# EAGLE design lamp (EAGLE 6.2)
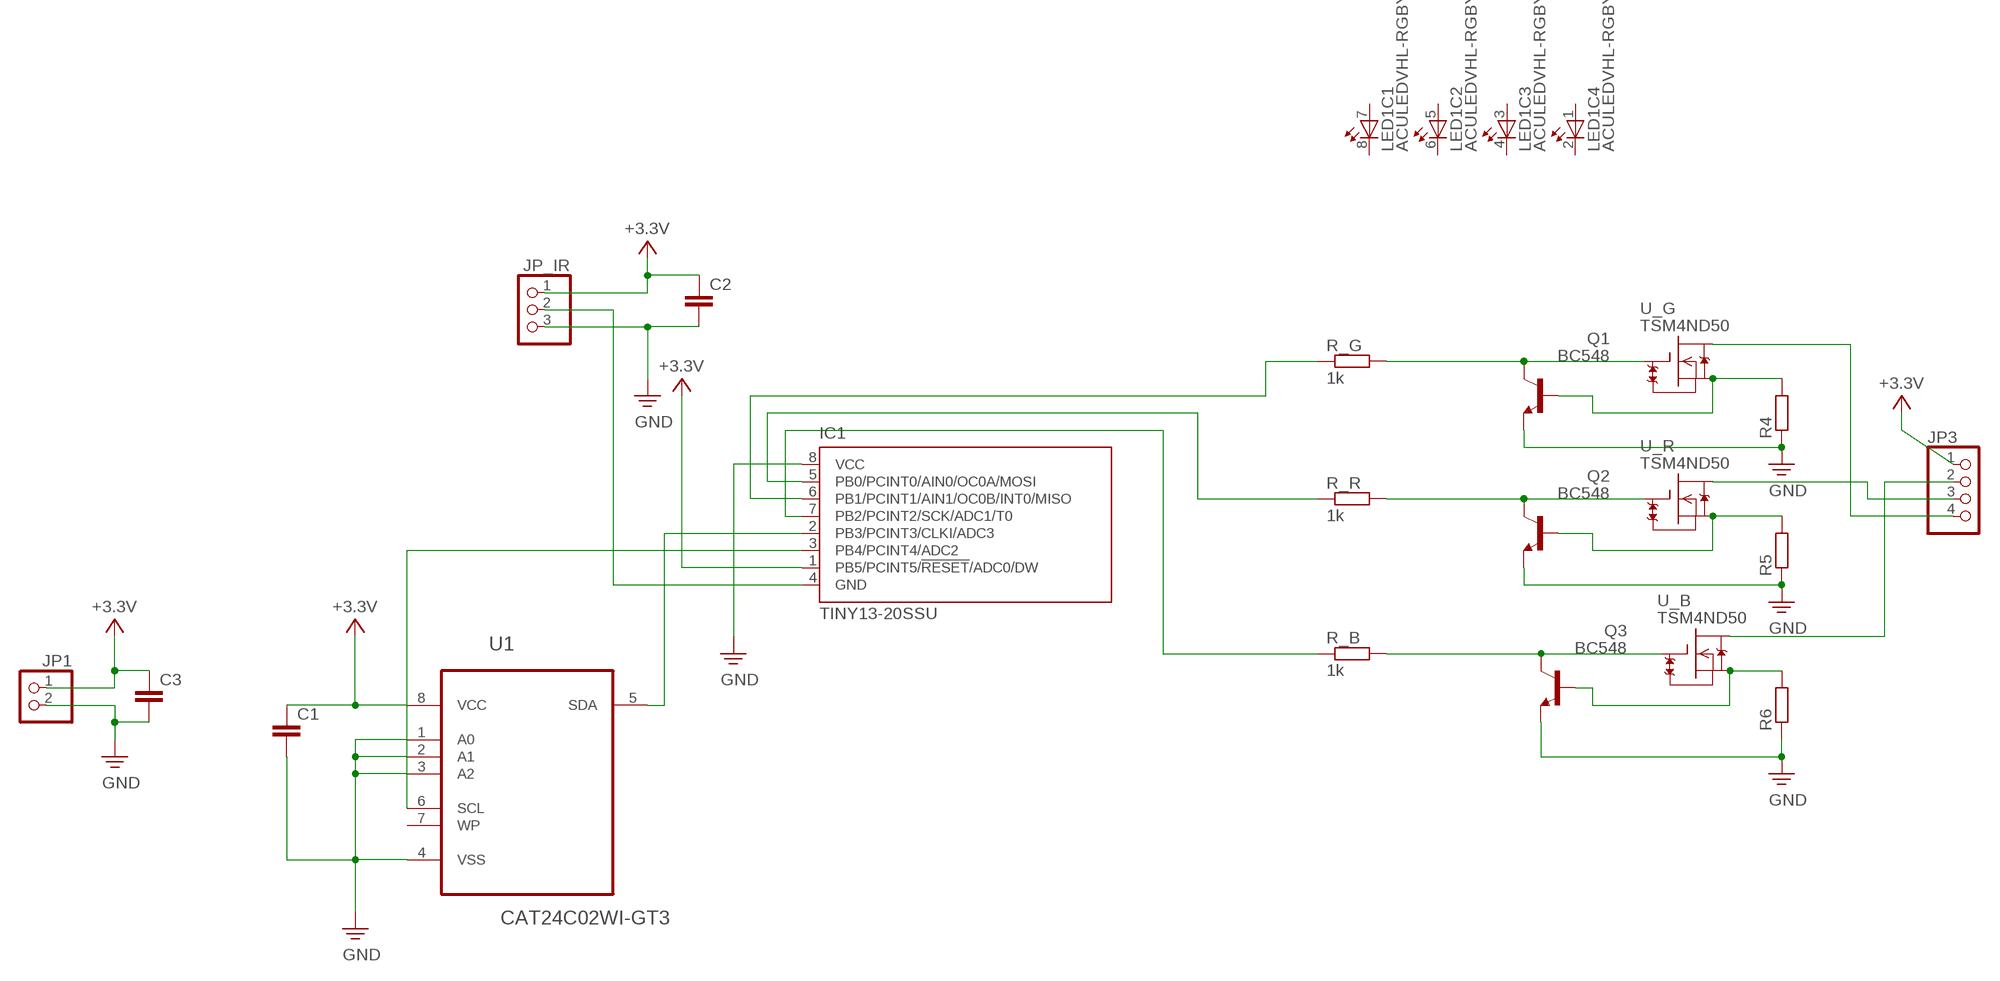
[diagram p0: schematic, sheet 1]

## Parts
C1  C-EUC0805  [C0805]
C2  C-EUC0805  [C0805]
C3  C-EUC0805  [C0805]
IC1  TINY13-20SSU  [8S1]
JP1  PINHD-1X2  [1X02]
JP3  PINHD-1X4  [1X04]
JP_IR  PINHD-1X3  [1X03]
LED1  ACULEDVHL-RGBY  [ACULEDVHL]
Q1  BC548  [TO92-EBC]
Q2  BC548  [TO92-EBC]
Q3  BC548  [TO92-EBC]
R4  R-EU_0204/2V  [0204V]
R5  R-EU_0204/2V  [0204V]
R6  R-EU_0204/2V  [0204V]
R_B  1k  R-EU_R0805  [R0805]
R_G  1k  R-EU_R0805  [R0805]
R_R  1k  R-EU_R0805  [R0805]
U1  CAT24C02WI-GT3  [SOIC127P600X175-8N]
U_B  TSM4ND50  [TO252]
U_G  TSM4ND50  [TO252]
U_R  TSM4ND50  [TO252]

## Nets
B: JP3.2 U_B.D
G: JP3.4 U_G.D
N$1: IC1.2(PB3/PCINT3/CLKI/ADC3) U1.5(SDA)
N$2: IC1.3(PB4/PCINT4/ADC2) U1.6(SCL)
N$3: IC1.4(GND) JP_IR.2
N$4: Q1.C R_G.2 U_G.G
N$5: IC1.7(PB2/PCINT2/SCK/ADC1/T0) R_B.1
N$6: IC1.5(PB0/PCINT0/AIN0/OC0A/MOSI) R_R.1
N$7: IC1.6(PB1/PCINT1/AIN1/OC0B/INT0/MISO) R_G.1
N$8: Q1.B R4.2 U_G.S
N$11: Q2.C R_R.2 U_R.G
N$13: Q2.B R5.2 U_R.S
N$15: Q3.C R_B.2 U_B.G
N$16: Q3.B R6.2 U_B.S
PE: C1.2 C2.2 C3.2 IC1.8(VCC) JP1.2 JP_IR.3 Q1.E Q2.E Q3.E R4.1 R5.1 R6.1 U1.1(A0) U1.2(A1) U1.3(A2) U1.4(VSS) ; supply symbol labelled GND
R: JP3.3 U_R.D
VCC: C1.1 C2.1 C3.1 IC1.1(PB5/PCINT5/!RESET!/ADC0/DW) JP1.1 JP3.1 JP_IR.1 U1.8(VCC) ; supply symbol labelled +3.3V
Unconnected: LED1.1(C4:A) LED1.2(C4:C) LED1.3(C3:A) LED1.4(C3:C) LED1.5(C2:A) LED1.6(C2:C) LED1.7(C1:A) LED1.8(C1:C) U1.7(WP)

## Library data of the parts
C1-C3 = rcl:C-EU: CAPACITOR, European symbol
IC1 = atmel:TINY13: 8-bit AVR Microcontroller with 1K Bytes In-System Programmable Flash Source: http://www.atmel.com/dyn/resources/prod_documents/2535S.pdf; MPN: ATTINY13-20SSU; OC_FARNELL: 1455133; OC_NEWARK: 58M3771
JP1 = pinhead:PINHD-1X2: PIN HEADER
JP3 = pinhead:PINHD-1X4: PIN HEADER
JP_IR = pinhead:PINHD-1X3: PIN HEADER
LED1 = led:ACULEDVHL: ACULED® VHL Standard Monochromatic and Multi-Colored Four-Chip LED Source: http://optoelectronics.perkinelmer.com/content/Datasheets/DTS_ACULEDVHL.pdf
Q1-Q3 = transistor-npn:BC548*: NPN Transistor
R4-R6 R_B R_G R_R = rcl:R-EU_: RESISTOR, European symbol
U1 = 24C02:CAT24C02WI-GT3: CMOS Serial EEPROM; MPN: CAT24C02WI-GT3; OC_FARNELL: 1718120; OC_NEWARK: 08R5403; PACKAGE: SOIC-8; SUPPLIER: CATALYST SEMICONDUCTOR
U_B U_G U_R = TSM4ND50:TSM4ND50: MOSFET,N CH,500V,3A,TO252 Transistor Polarity: N Channel Continuous Drain Current Id: 3A Drain Source Voltage Vds: 500V On Resistance Rds(on): 2.3ohm Rds(on) Test Voltage Vgs: 10V Power Dissipation Pd: 45W Operating Temperature Range: -55°C to +150°C Transistor Case Style: TO-252 No. of Pins: 3 SVHC: No SVHC (18-Jun-2012) Power Dissipation Pd: 45W Voltage Vgs Max: 30V

## Board
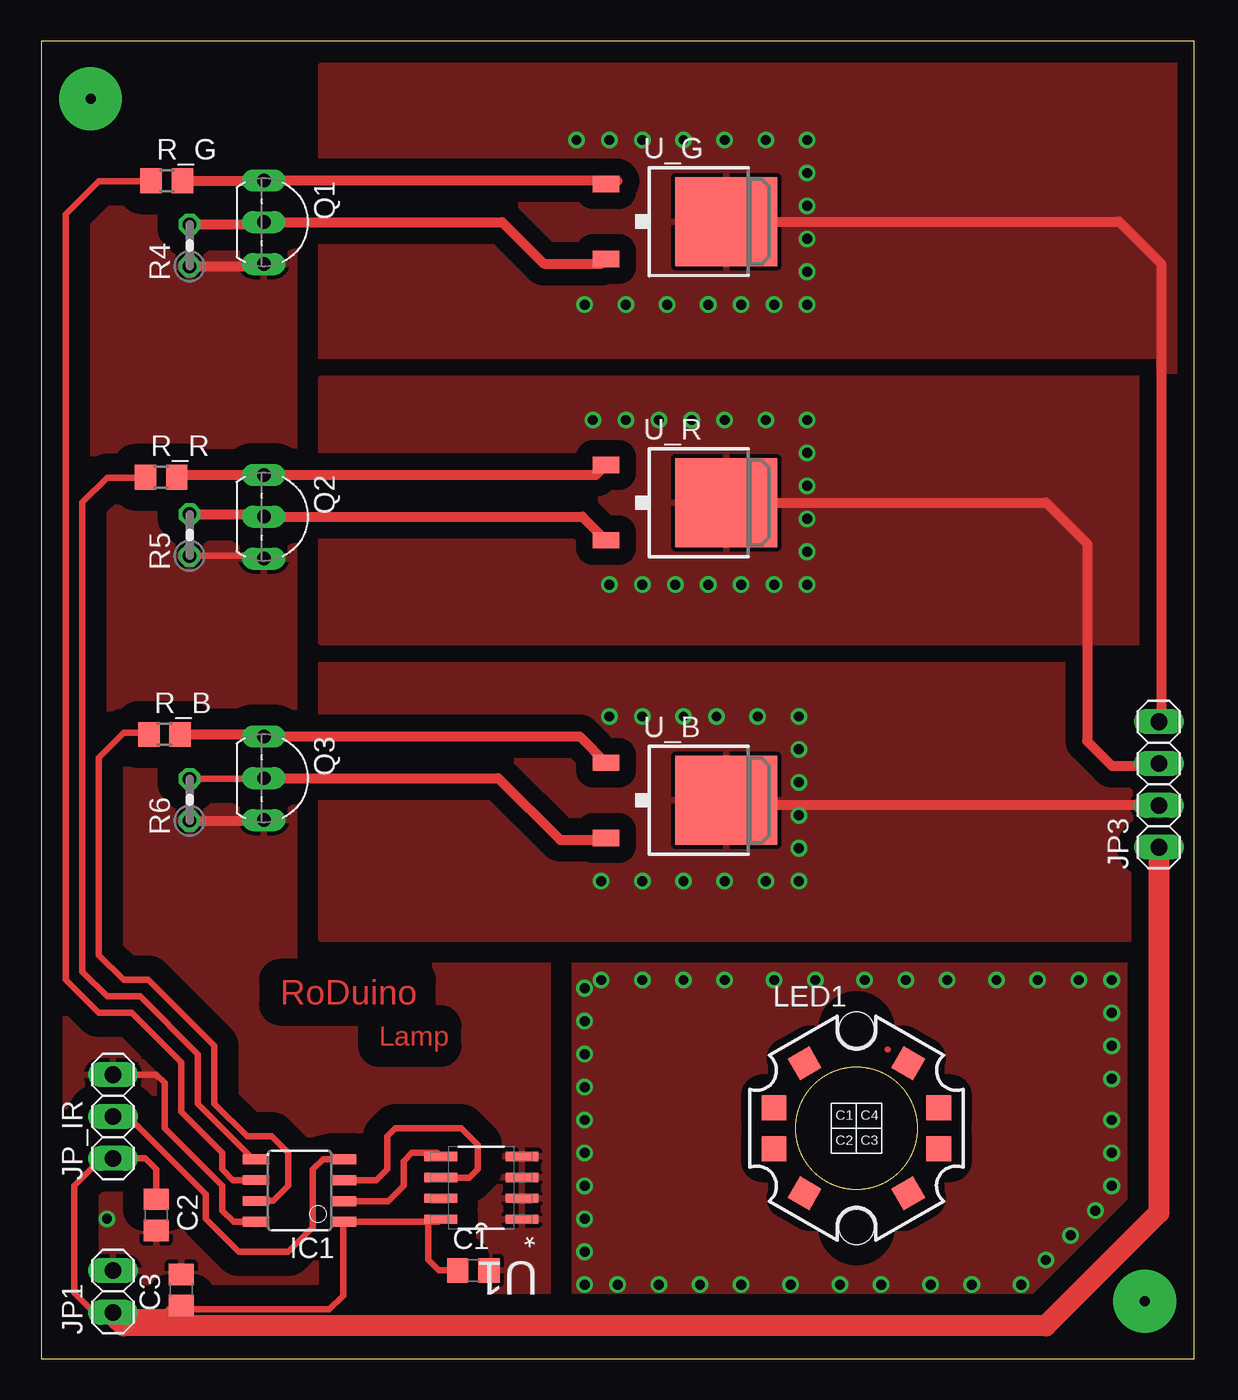
[diagram p1: board, top side]
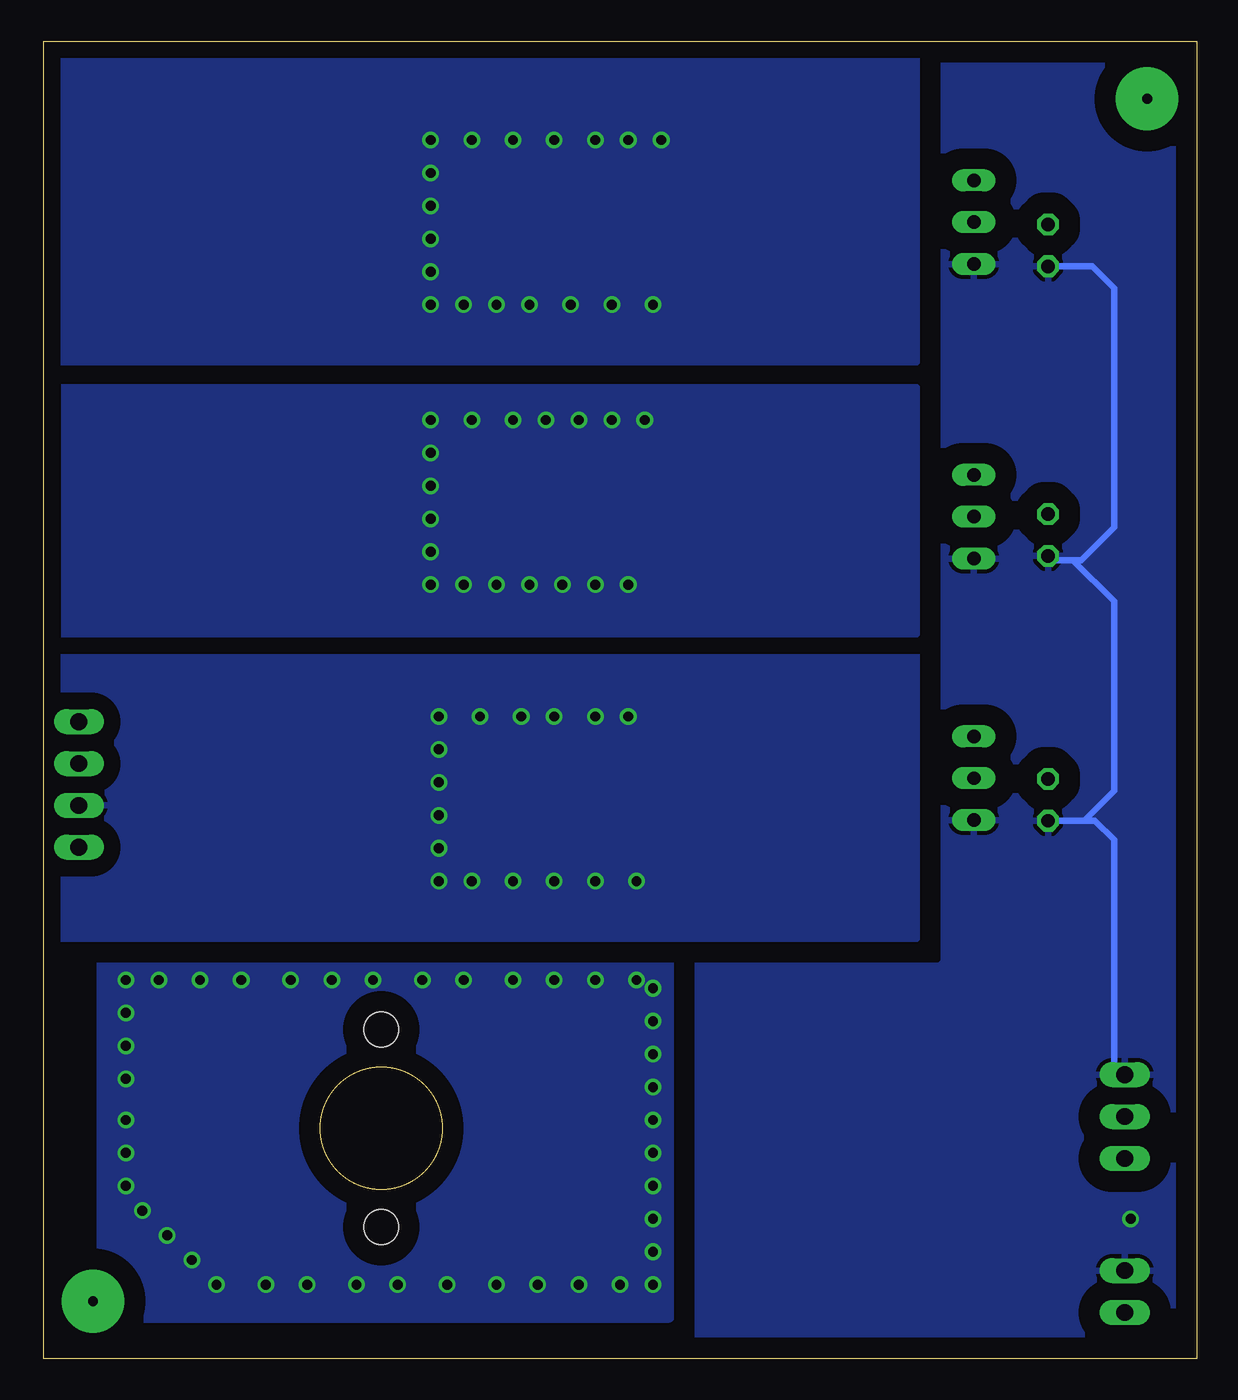
[diagram p2: board, bottom side, seen from below]

Size 70 x 80 mm. Coordinates in mm from the lower left corner, seen from the top.
Outline: 0,0 70,0 70,80 0,80 0,0
Copper layers (1*16): Top 0.035mm / dielectric 1.5mm / Bottom 0.035mm
Design rules: minimum track width 10mil, minimum drill 24mil, track to track 8mil, track to pad 8mil, pad to pad 8mil, via to via 8mil, smd to smd 8mil, copper to edge 40mil, drill to drill 8mil, minimum pad ring 10mil, minimum via ring 8mil, stop-mask expansion 4mil, vias tented up to drill 0mil, thermal gap 10mil

### Footprints (pad centres in the part's own frame; a part is rotated, then mirrored left to right if it is on the bottom)
C0805 = smd 1.3 x 1.5: 1 -0.95,0; 2 0.95,0
8S1 = smd 0.6 x 1.6: 1 -1.905,-2.654; 2 -0.645,-2.654; 3 0.625,-2.654; 4 1.895,-2.654; 5 1.905,2.654; 6 0.635,2.654; 7 -0.635,2.654; 8 -1.905,2.654
1X02 = drill 1.016 long: 1 -1.27,0; 2 1.27,0
1X04 = drill 1.016 long: 1 -3.81,0; 2 -1.27,0; 3 1.27,0; 4 3.81,0
1X03 = drill 1.016 long: 1 -2.54,0; 2 0,0; 3 2.54,0
ACULEDVHL = smd 1.5 x 1.5 rotated 60: 1 3.15,3.95 | smd 1.5 x 1.5: 2 5,1.25; 3 5,-1.25; 6 -5,-1.25; 7 -5,1.25 | smd 1.5 x 1.5 rotated 300: 4 3.15,-3.95 | smd 1.5 x 1.5 rotated 240: 5 -3.15,-3.95 | smd 1.5 x 1.5 rotated 120: 8 -3.15,3.95 | hole 2.1: 0,6; 0,-6
TO92-EBC = drill 0.813 long: B 0,-1.27; C -2.54,-1.27; E 2.54,-1.27
0204V = drill 0.813 octagon: 1 -1.27,0; 2 1.27,0
R0805 = smd 1.3 x 1.5: 1 -0.95,0; 2 0.95,0
SOIC127P600X175-8N = smd 1.981 x 0.559: 1 -2.464,1.905; 2 -2.464,0.635; 3 -2.464,-0.635; 4 -2.464,-1.905; 5 2.464,-1.905; 6 2.464,-0.635; 7 2.464,0.635; 8 2.464,1.905
TO252 = smd 5.4 x 6.2: D 0,1.23 | smd 1 x 1.6: G -2.28,-6.07; S 2.28,-6.07

### Placement (x,y rotation side)
C1  26.24,5.37 0 top
C2  6.99,8.74 270 top
C3  8.51,4.18 90 top
IC1  15.69,10.22 90 top
JP1  4.36,4.09 90 top
JP3  67.86,34.87 90 top
JP_IR  4.36,14.71 90 top
LED1  49.5,14 0 top
Q1  14.79,69.01 270 top
Q2  14.79,51.13 270 top
Q3  14.79,35.25 270 top
R4  9.01,67.6 90 top
R5  9.01,50.02 90 top
R6  9.01,33.94 90 top
R_B  7.49,37.91 0 top
R_G  7.63,71.52 0 top
R_R  7.28,53.52 0 top
U1  26.72,10.38 180 top
U_B  40.36,33.91 270 top
U_G  40.36,69.05 270 top
U_R  40.36,51.98 270 top

### Tracks (layer width: path | path; a pad name or v marks a point on that pad's centre or on a via)
B  (via drill 0.6)
  Top 0.61: JP3.2 41.9,33.6 U_B.D
  other vias: 34.5,39 36.5,39 39,39 41,39 43.5,39 46,39 46,37 46,35 46,33 46,31 46,29 44,29 41.5,29 39,29 36.5,29 34,29
  pour Top (isolate 1.016, rank 2): 17,43 69.5,43 69.5,25.5 17,25.5
  pour Bottom (isolate 1.016, rank 2): 17,43 69.5,43 69.5,25.5 17,25.5
G  (via drill 0.6)
  Top 0.61: U_G.D 65.45,69.05 68,66.5 68,38.82 JP3.4
  other vias: 32.5,74 34.5,74 36.5,74 39,74 41.5,74 44,74 46.5,74 46.5,72 46.5,70 46.5,68 46.5,66 46.5,64 44.5,64 42.5,64 40.5,64 38,64 35.5,64 33,64
  pour Top (isolate 1.016, rank 2): 17,78.5 69.5,78.5 69.5,60 17,60
  pour Bottom (isolate 1.016): 17,60.5 69.5,60.5 69.5,79.5 17,79.5
N$1
  Top 0.406: IC1.2 21.07,9.57 22,10.5 22,12 22.5,12.5 24.04,12.5 U1.5
N$2
  Top 0.406: IC1.3 20.34,10.85 21,11.5 21,13.5 21.5,14 25.5,14 26.5,13 26.5,11.5 26,11 24.27,11 U1.6
N$3
  Top 0.406: IC1.4 17.11,12.12 16.5,11.5 16.5,8 15,6.5 12,6.5 10,8.5 10,10 5.5,14.5 4.07,14.5 JP_IR.2
N$4
  Top 0.61: R_G.2 13.49,71.52 Q1.C 34.95,71.55 35,71.5 34.46,71.5 U_G.G
N$5
  Top 0.406: IC1.7 14.09,9.59 15,10.5 15,12.5 14,13.5 12.5,13.5 10.5,15.5 10.5,19 6.5,23 5,23 3.5,24.5 3.5,36.5 5,38 6.45,38 R_B.1
N$6
  Top 0.406: IC1.5 12.88,12.12 9.5,15.5 9.5,18.5 6,22 4,22 2.5,23.5 2.5,52 4,53.5 6.31,53.5 R_R.1
N$7
  Top 0.406: IC1.6 11.64,10.86 11,11.5 11,12.5 8.5,15 8.5,18 5.5,21 3.5,21 1.5,23 1.5,69.5 3.5,71.5 6.66,71.5 R_G.1
N$8
  Top 0.61: R4.2 13.38,68.87 Q1.B 27.99,69.01 30.5,66.5 34.02,66.5 U_G.S
N$10  (via drill 0.6)
  other vias: 33,22.5 33,20.5 33,18.5 33,16.5 33,14.5 33,12.5 33,10.5 33,8.5 33,6.5 33,4.5 35,4.5 37.5,4.5 40,4.5 42.5,4.5 45.5,4.5 48.5,4.5 51,4.5 54,4.5 56.5,4.5 59.5,4.5 61,6 62.5,7.5 64,9 65,10.5 65,12.5 65,14.5 65,17 65,19 65,21 65,23 63,23 60.5,23 58,23 55,23 52.5,23 50,23 47,23 44.5,23 41.5,23 39,23 36.5,23 34,23
  pour Top (isolate 1.27, rank 3): 32.5,2.5 66.5,2.5 66.5,25 32.5,25
  pour Bottom (isolate 1.27, rank 3): 32,25 66.5,25 66.5,2.5 32,2.5
N$11
  Top 0.61: R_R.2 8.38,53.67 Q2.C 33.7,53.67 U_R.G
N$12  (via drill 0.6 pad 3.81)
  other vias: 3,76.5
N$13
  Top 0.61: R5.2 13.36,51.29 Q2.B 32.86,51.13 U_R.S
N$14  (via drill 0.6 pad 3.81)
  other vias: 67,3.5
N$15
  Top 0.61: R_B.2 13.4,37.91 Q3.C 32.69,37.79 U_B.G
N$16
  Top 0.406: R6.2 13.48,35.21 Q3.B
  Top 0.61: Q3.B 27.75,35.25 31.5,31.5 34.16,31.5 U_B.S
PE  (via drill 0.6)
  Top 0.406: R5.1 13.36,48.75 Q2.E | IC1.8 11.69,8.31 11,9 11,10.5 7.5,14 7.5,16.75 7,17.25 JP_IR.3
  Top 0.61: R4.1 13.38,66.33 Q1.E | R6.1 13.48,32.67 Q3.E
  Bottom 0.406: R4.1 6.33,66.33 5,65 5,50.5 7,48.5 7.5,48.5 | 7.5,48.5 8.76,48.5 R5.1 | R6.1 6.83,32.67 | 6.83,32.67 5,34.5 5,46 7.5,48.5 | 6.83,32.67 6.17,32.67 5,31.5 5,17.89 JP_IR.3
  other vias: 4,8.5
  pour Top (isolate 1.27, rank 4): 0.5,79.5 70,79.5 70,0.5 0.5,0.5
  pour Bottom (isolate 1.27, rank 4): 0,80 70,80 70,0 0,0
R  (via drill 0.6)
  Top 0.61: U_R.D 61.02,51.98 63.5,49.5 63.5,37.5 65,36 67.72,36 JP3.3
  other vias: 33.5,57 35.5,57 37.5,57 39.5,57 41.5,57 44,57 46.5,57 46.5,55 46.5,53 46.5,51 46.5,49 46.5,47 44.5,47 42.5,47 40.5,47 38.5,47 36.5,47 34.5,47
  pour Top (isolate 1.016): 17,59.5 69.5,59.5 69.5,43.5 17,43.5
  pour Bottom (isolate 1.016): 17,59 69,59 69,44 17,44
VCC
  Top 0.406: 23.5,8.31 IC1.1 18.34,3.84 17.5,3 7.74,3 C3.1 7.51,2.82 JP1.1 4.18,3 3,3 2,4 2,10.5 3.67,12.17 JP_IR.1 6.33,12.17 6.99,11.51 C2.1 | 23.5,8.31 24.1,8.31 U1.8 | C1.1 24.13,5.37 23.5,6 23.5,8.31
  Top 1.27: JP3.1 67.86,8.86 61,2 5,2 4.5,2.5 4.5,2.68 JP1.1

### Text on the board
Top: RoDuino | Lamp